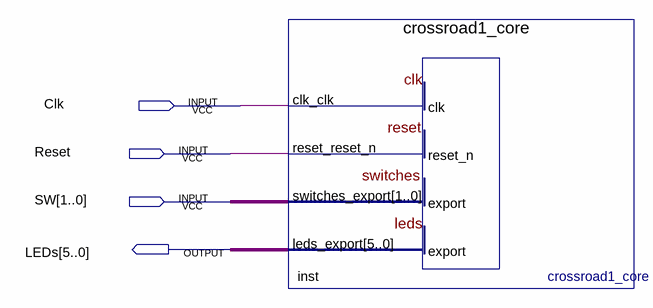
[diagram p0: schematic sheet]
// Quartus schematic crossroad1.bdf as structural Verilog: 1 symbols, 4 pins
module crossroad1 (
  input  Clk,
  input  Reset,
  input  [1:0] SW,
  output [5:0] LEDs
);

  crossroad1_core inst (.clk_clk(Clk), .reset_reset_n(Reset), .switches_export(SW), .leds_export(LEDs));
endmodule
